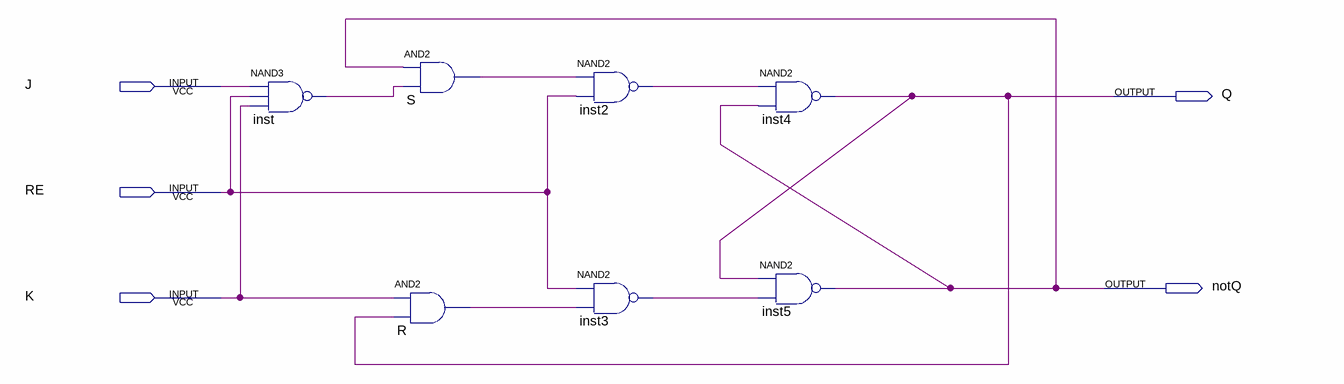
[diagram p0: schematic sheet]
// Quartus schematic flip-flop-jk-stable.bdf as structural Verilog: 7 symbols, 5 pins
module \flip-flop-jk-stable  (
  input  J,
  input  RE,
  input  K,
  output Q,
  output notQ
);

  wire inst2_out, inst3_out, inst_out, R_out, S_out;

  nand inst (inst_out, J, RE, K);
  and S (S_out, notQ, inst_out);
  and R (R_out, K, Q);
  nand inst2 (inst2_out, S_out, RE);
  nand inst3 (inst3_out, RE, R_out);
  nand inst4 (Q, inst2_out, notQ);
  nand inst5 (notQ, Q, inst3_out);
endmodule
